# EAGLE design inputs (EAGLE 8.6.0)
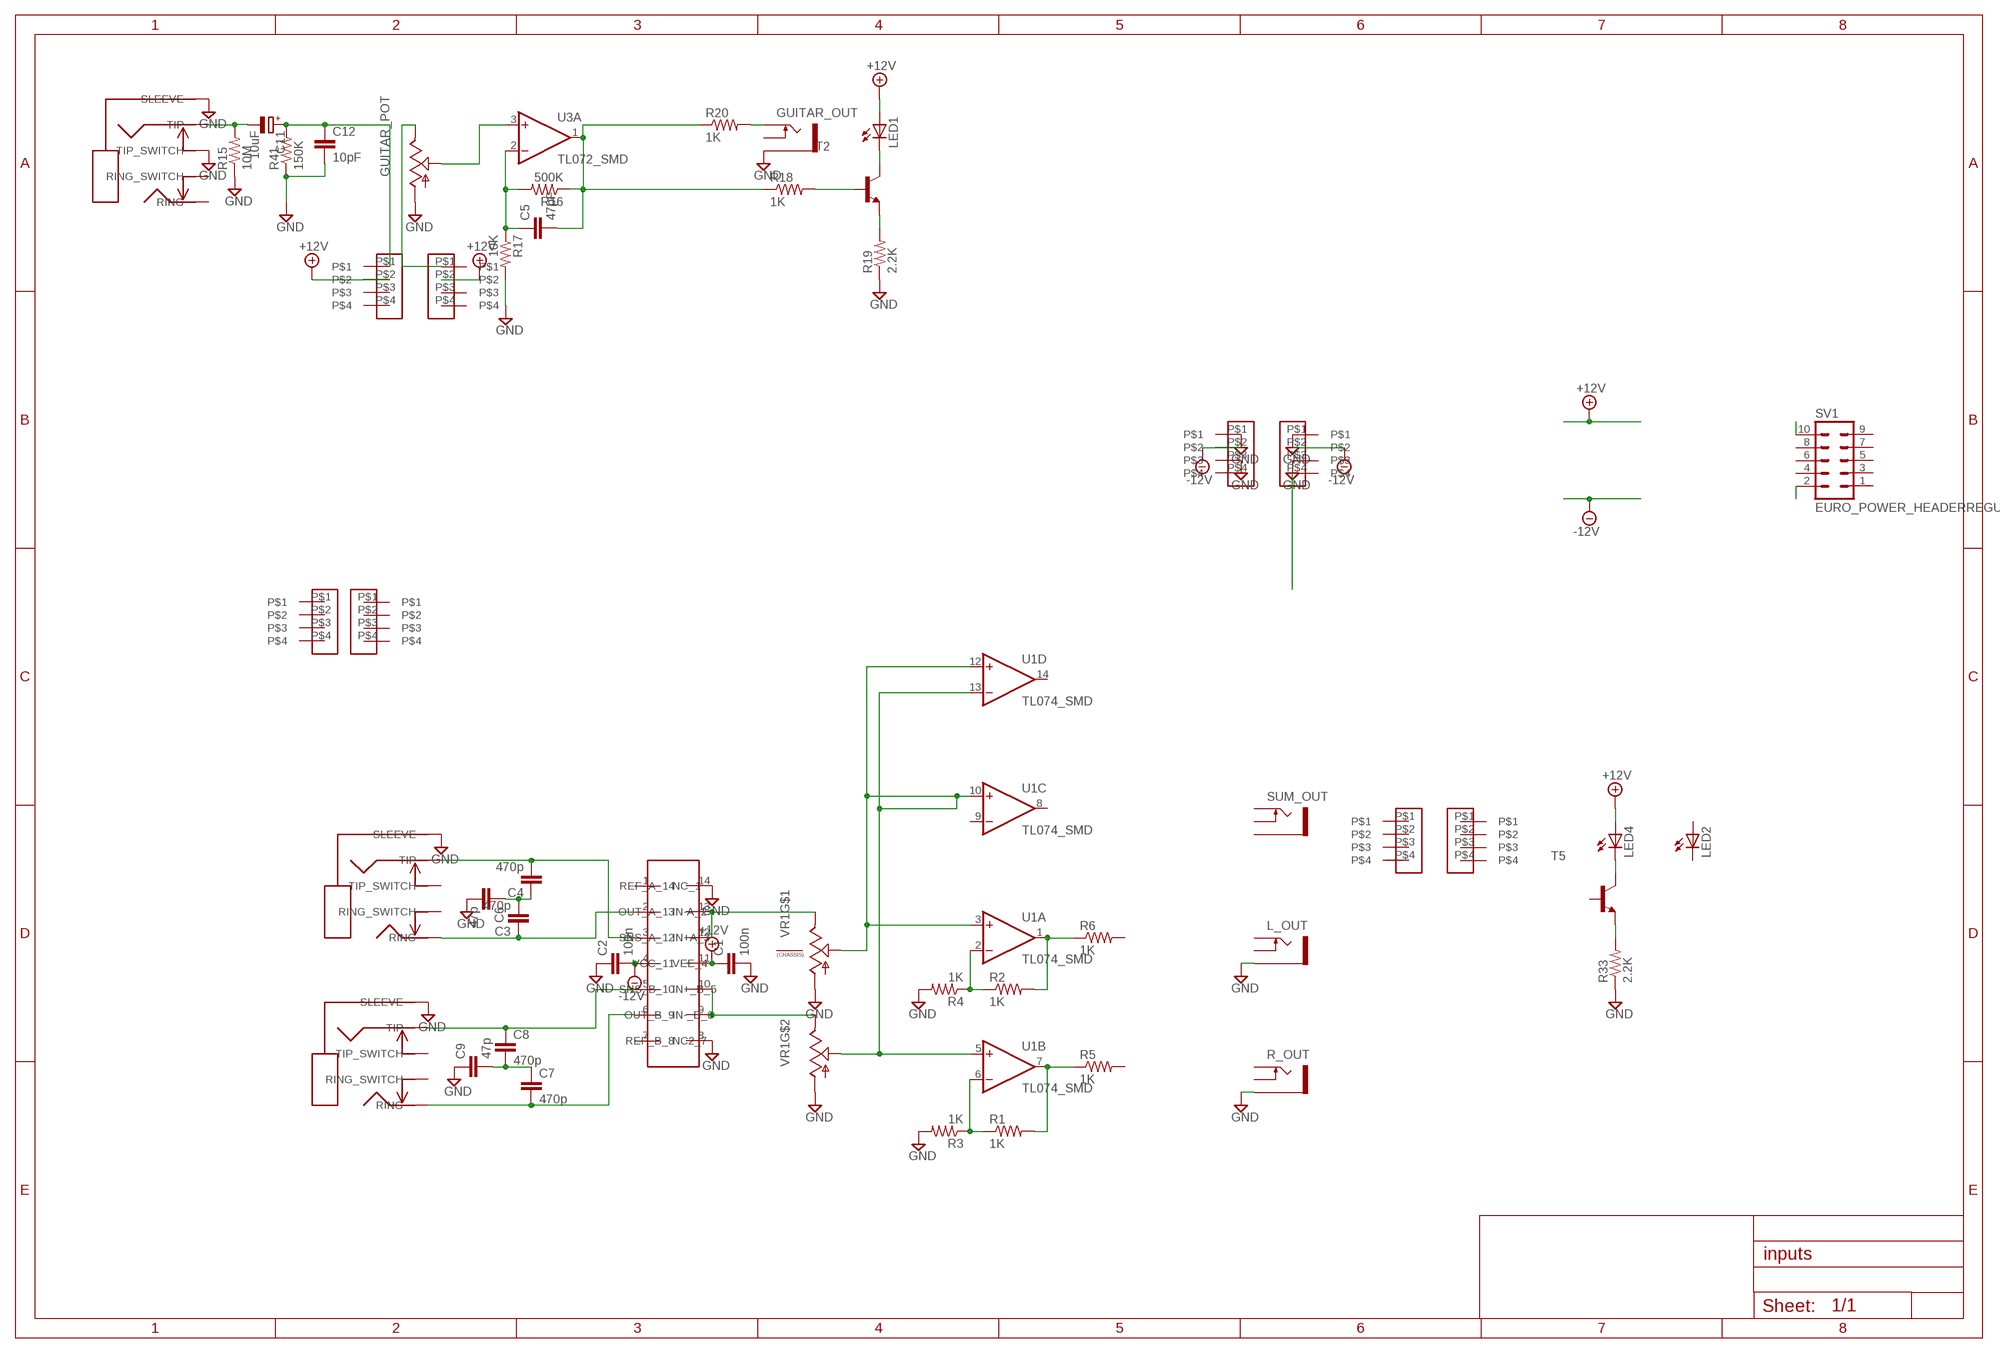
[diagram p0: schematic, sheet 1]

## Parts
C1  100n  C-EUC0603  [C0603]
C2  100n  C-EUC0603  [C0603]
C3  470p  C-EUC0603  [C0603]
C4  470p  C-EUC0603  [C0603]
C5  47pF  C-EUC0603  [C0603]
C6  47p  C-EUC0603  [C0603]
C7  470p  C-EUC0603  [C0603]
C8  470p  C-EUC0603  [C0603]
C9  47p  C-EUC0603  [C0603]
C11  10uF  CPOL-EUB  [PANASONIC_B]
C12  10pF  C-EUC0603  [C0603]
GUITAR_INPUT  WQP-PJ612A  [JACK]
GUITAR_OUT  THONKICONNNEW  [WQP-PJ301M-12_JACK]
GUITAR_POT  9MM_SNAP-IN_POT_  [9MM_SNAP-IN_POT]
L_IN  WQP-PJ612A  [JACK]
L_OUT  THONKICONNNEW  [WQP-PJ301M-12_JACK]
LB_B  4PIN_HEADER  [4PIN]
LB_O  4PIN_HEADER  [4PIN]
LED1  LED3MM  [LED3MM]
LED2  LED3MM  [LED3MM]
LED4  LED3MM  [LED3MM]
R1  1K  R-US_R0603  [R0603]
R2  1K  R-US_R0603  [R0603]
R3  1K  R-US_R0603  [R0603]
R4  1K  R-US_R0603  [R0603]
R5  1K  R-US_R0603  [R0603]
R6  1K  R-US_R0603  [R0603]
R15  10M  R-US_R0603  [R0603]
R16  500K  R-US_R0603  [R0603]
R17  10K  R-US_R0603  [R0603]
R18  1K  R-US_R0603  [R0603]
R19  2.2K  R-US_R0603  [R0603]
R20  1K  R-US_R0603  [R0603]
R33  2.2K  R-US_R0603  [R0603]
R41  150K  R-US_R0603  [R0603]
R-IN  WQP-PJ612A  [JACK]
R_OUT  THONKICONNNEW  [WQP-PJ301M-12_JACK]
RB_B  4PIN_HEADER  [4PIN]
RB_B1  4PIN_HEADER  [4PIN]
RB_O  4PIN_HEADER  [4PIN]
RB_O1  4PIN_HEADER  [4PIN]
RO_B  4PIN_HEADER  [4PIN]
RO_O  4PIN_HEADER  [4PIN]
SUM_OUT  THONKICONNNEW  [WQP-PJ301M-12_JACK]
SV1  EURO_POWER_HEADERREGULAR  [EURO_POWER_HEADER]
T2  MMBT3904LT1-NPN-SOT23-BEC  [SOT23-BEC]
T5  MMBT3904LT1-NPN-SOT23-BEC  [SOT23-BEC]
U1  TL074_SMD  [SO14]
U3  TL072_SMD  [SO08]
U$1  THAT1280  [SO-14]
VR1  ALPHA-9MM-DUALPOT  [DUAL_9MM_SNAP-IN_POT]

## Nets
+12V: C1.1 LB_B.P$2 LB_O.P$2 LED1.A LED4.A U$1.11(VCC_11)
-12V: C2.2 RB_B.P$2 RB_O.P$2 U$1.4(VEE_4)
GND: C1.2 C2.1 C6.2 C9.1 C12.2 GUITAR_INPUT.PIN1(SLEEVE) GUITAR_INPUT.PIN5(TIP_SWITCH) GUITAR_OUT.P$3_SLEEVE(SLEEVE) GUITAR_POT.1(A) L_IN.PIN1(SLEEVE) L_OUT.P$3_SLEEVE(SLEEVE) R3.2 R4.2 R15.1 R17.2 R19.1 R33.1 R41.1 R-IN.PIN1(SLEEVE) R_OUT.P$3_SLEEVE(SLEEVE) RB_B.P$1 RB_B.P$3 RB_O.P$1 RB_O.P$3 U$1.8(REF_B_8) U$1.14(REF_A_14) VR1.1(A) VR1.1B(A)
N$1: C4.2 L_IN.PIN3(TIP) U$1.3(IN+A_3)
N$2: C11.- GUITAR_INPUT.PIN3(TIP) R15.2
N$3: C11.+ C12.1 LB_O.P$1 R41.2
N$4: U$1.9(OUT_B_9) U$1.10(SNS_B_10) VR1.3B(E)
N$5: C8.1 R-IN.PIN3(TIP) U$1.5(IN+_B_5)
N$6: C7.2 R-IN.PIN2(RING) U$1.6(IN-_B_6)
N$7: C3.1 L_IN.PIN2(RING) U$1.2(IN-A_2)
N$8: C7.1 C8.2 C9.2
N$9: C3.2 C4.1 C6.1
N$10: U$1.12(SNS_A_12) U$1.13(OUT_A_13) VR1.3(E)
N$11: R2.1 R4.1 U1.2(A:-IN)
N$12: U1.3(A:+IN) U1.5(B:+IN) U1.10(C:+IN) U1.12(D:+IN) U1.13(D:-IN) VR1.2(S) VR1.2B(S)
N$13: R2.2 R6.1 U1.1(A:OUT)
N$14: R1.1 R3.1 U1.6(B:-IN)
N$15: R1.2 R5.1 U1.7(B:OUT)
N$17: C5.2 R16.1 R18.1 R20.1 U3.1(A:OUT)
N$18: C5.1 R16.2 R17.1 U3.2(A:-IN)
N$19: GUITAR_OUT.P$1_TIP(TIP) R20.2
N$20: R18.2 T2.B
N$21: R19.2 T2.E
N$22: LED1.K(C) T2.C
N$27: RB_O.P$4
N$41: R33.2 T5.E
N$42: LED4.K(C) T5.C
N$54: GUITAR_POT.3(E) LB_B.P$1
N$57: GUITAR_POT.2(S) U3.3(A:+IN)
N$59: SV1.10
N$60: SV1.2
Unconnected: GUITAR_INPUT.PIN2(RING) GUITAR_INPUT.PIN4(RING_SWITCH) GUITAR_OUT.P$2_SWITCH(SWITCH) L_IN.PIN4(RING_SWITCH) L_IN.PIN5(TIP_SWITCH) L_OUT.P$1_TIP(TIP) L_OUT.P$2_SWITCH(SWITCH) LB_B.P$3 LB_B.P$4 LB_O.P$3 LB_O.P$4 LED2.A LED2.K(C) R5.2 R6.2 R-IN.PIN4(RING_SWITCH) R-IN.PIN5(TIP_SWITCH) R_OUT.P$1_TIP(TIP) R_OUT.P$2_SWITCH(SWITCH) RB_B1.P$1 RB_B1.P$2 RB_B1.P$3 RB_B1.P$4 RB_B.P$4 RB_O1.P$1 RB_O1.P$2 RB_O1.P$3 RB_O1.P$4 RO_B.P$1 RO_B.P$2 RO_B.P$3 RO_B.P$4 RO_O.P$1 RO_O.P$2 RO_O.P$3 RO_O.P$4 SUM_OUT.P$1_TIP(TIP) SUM_OUT.P$2_SWITCH(SWITCH) SUM_OUT.P$3_SLEEVE(SLEEVE) SV1.1 SV1.3 SV1.4 SV1.5 SV1.6 SV1.7 SV1.8 SV1.9 T5.B U1.8(C:OUT) U1.9(C:-IN) U1.14(D:OUT) U3.5(B:+IN) U3.6(B:-IN) U3.7(B:OUT) U$1.1(NC_1) U$1.7(NC2_7) VR1.CHASSIS1 VR1.CHASSIS2

## Power pins joined to a net without a drawn wire
V+: U1.4(P:V+) U3.8(P:V+)
V-: U1.11(P:V-) U3.4(P:V-)

## Library data of the parts
C1-C9 C12 = resistor:C-EU: CAPACITOR, European symbol
C11 = resistor:CPOL-EU: POLARIZED CAPACITOR, European symbol
GUITAR_INPUT L_IN R-IN = Chrisvossetje:WQP-PJ612A
GUITAR_OUT L_OUT R_OUT SUM_OUT = MusicThingModular:THONKICONN: 3.5mm socket for Eurorack modular synths
GUITAR_POT = MusicThingModular:9MM_SNAP-IN_POT: 9mm vertical snap-in pot, Alpha / Panasonic style
LB_B LB_O RB_B RB_B1 RB_O RB_O1 RO_B RO_O = Chrisvossetje:4PIN_HEADER
LED1 LED2 LED4 = led:LED: LED OSRAM: - CHIPLED LG R971, LG N971, LY N971, LG Q971, LY Q971, LO R971, LY R971 LH N974, LH R974 LS Q976, LO Q976, LY Q976 LO Q996 - Hyper CHIPLED LW Q18S LB Q993, LB Q99A, LB R99A - SideLED LS A670, LO A670, LY A670, LG A670, LP A670 LB A673, LV A673, LT A673, LW A673 LH A674 LY A675 LS A676, LA A676, LO A676, LY A676, LW A676 LS A679, LY A679, LG A679 - Hyper Micro SIDELED® LS Y876, LA Y876, LO Y876, LY Y876 LT Y87S - SmartLED LW L88C, LW L88S LB L89C, LB L89S, LG L890 LS L89K, LO L89K, LY L89K LS L896, LA L896, LO L896, LY L896 - TOPLED LS T670, LO T670, LY T670, LG T670, LP T670 LSG T670, LSP T670, LSY T670, LOP T670, LYG T670 LG T671, LOG T671, LSG T671 LB T673, LV T673, LT T673, LW T673 LH T674 LS T676, LA T676, LO T676, LY T676, LB T676, LH T676, LSB T676, LW T676 LB T67C, LV T67C, LT T67C, LS T67K, LO T67K, LY T67K, LW E67C LS E67B, LA E67B, LO E67B, LY E67B, LB E67C, LV E67C, LT E67C LW T67C LS T679, LY T679, LG T679 LS T770, LO T770, LY T770, LG T770, LP T770 LB T773, LV T773, LT T773, LW T773 LH T774 LS E675, LA E675, LY E675, LS T675 LS T776, LA T776, LO T776, LY T776, LB T776 LHGB T686 LT T68C, LB T68C - Hyper Mini TOPLED® LB M676 - Mini TOPLED Santana® LG M470 LS M47K, LO M47K, LY M47K Source: http://www.osram.convergy.de LUXEON: - LUMILED® LXK2-PW12-R00, LXK2-PW12-S00, LXK2-PW14-U00, LXK2-PW14-V00 LXK2-PM12-R00, LXK2-PM12-S00, LXK2-PM14-U00 LXK2-PE12-Q00, LXK2-PE12-R00, LXK2-PE12-S00, LXK2-PE14-T00, LXK2-PE14-U00 LXK2-PB12-K00, LXK2-PB12-L00, LXK2-PB12-M00, LXK2-PB14-N00, LXK2-PB14-P00, LXK2-PB14-Q00 LXK2-PR12-L00, LXK2-PR12-M00, LXK2-PR14-Q00, LXK2-PR14-R00 LXK2-PD12-Q00, LXK2-PD12-R00, LXK2-PD12-S00 LXK2-PH12-R00, LXK2-PH12-S00 LXK2-PL12-P00, LXK2-PL12-Q00, LXK2-PL12-R00 Source: www.luxeon.com KINGBRIGHT: KA-3528ASYC Source: www.kingbright.com
R1-R6 R15-R20 R33 R41 = resistor:R-US_: RESISTOR, American symbol
SV1 = MusicThingModular:EURO_POWER_HEADER: Power Header 10 pin power header for Eurorack Power Supplies Variants with fatter pads for easier soldering, and the LOCK variant which has 5mil offset pins to hold the component in place before soldering
T2 T5 = MusicThingModular:*-NPN-: NPN Transistror BF959 corrected 2008.03.06
U1 = MusicThingModular:TL074: Generic Quad Op Amp
U3 = MusicThingModular:TL072: Generic Dual Op Amp
U$1 = Chrisvossetje:THAT1280
VR1 = MusicThingModular:ALPHA-9MM-DUALPOT: 9mm vertical snap-in pot, Alpha / Panasonic style, with a connection to the metal chassis for grounding

## Board
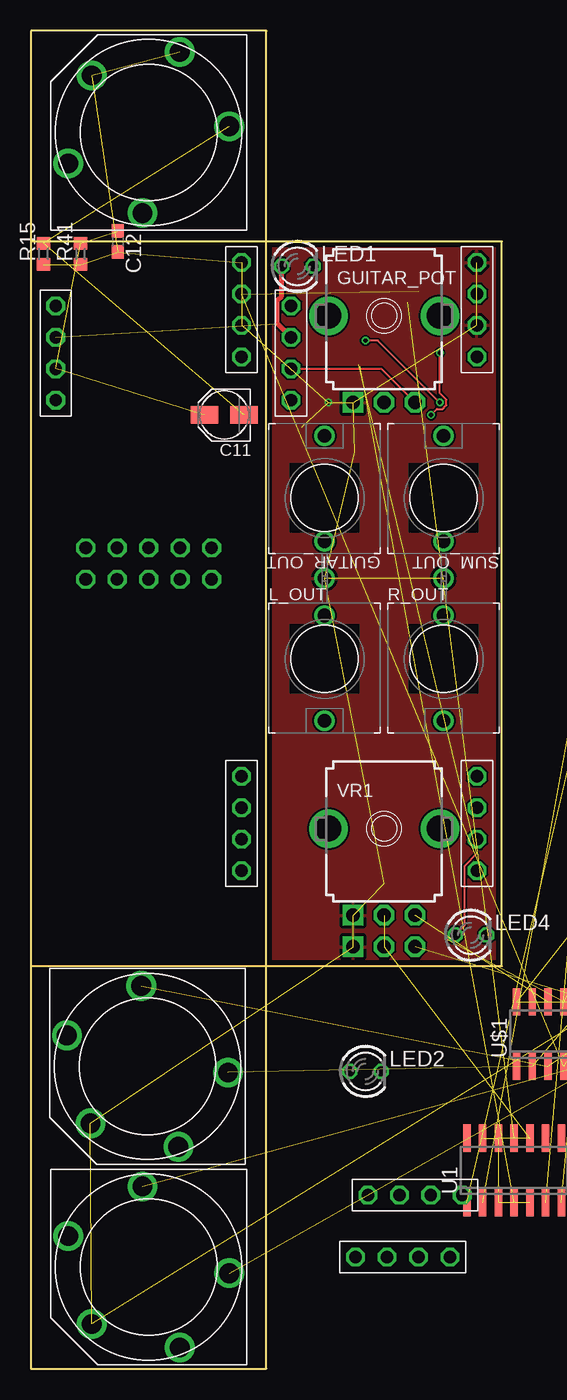
[diagram p1: board, top side]
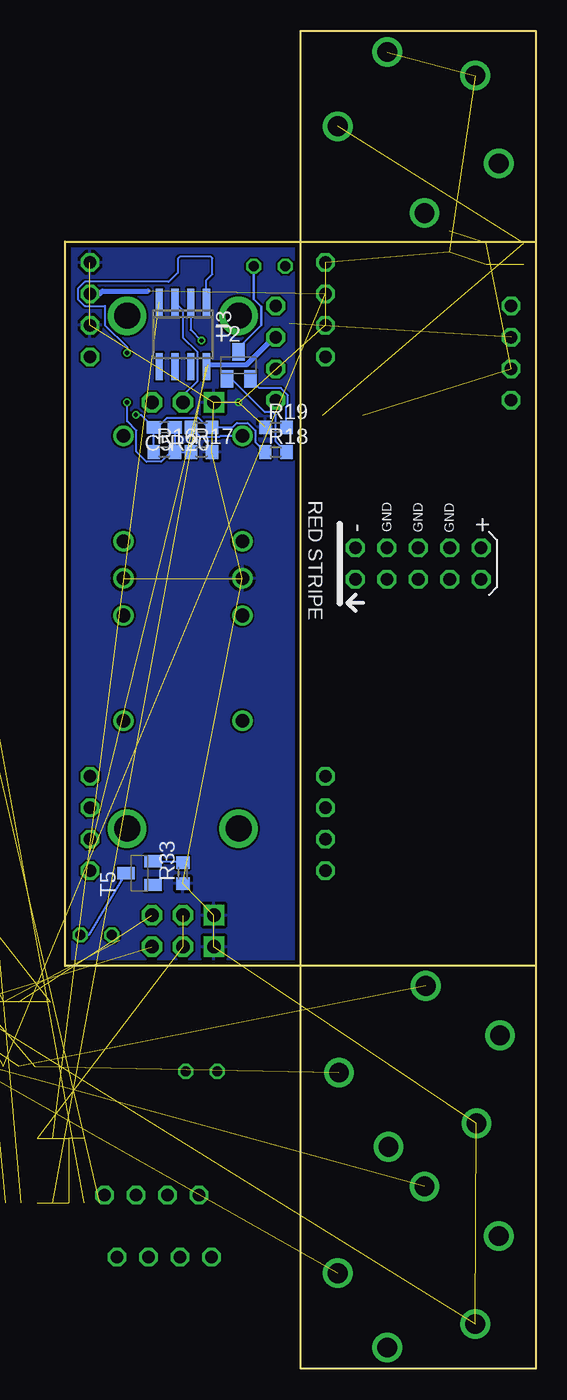
[diagram p2: board, bottom side, seen from below]

Size 38 x 108 mm. Coordinates in mm from the lower left corner, seen from the top.
Outline: 0,91 0,108 19,108 19,0 0,0 0,32.5
Outline: 0,32.5 38,32.5 38,91 0,91
Outline: 0,91 0,32.5
Copper layers (1*16): Top 0.035559375mm / dielectric 1.6mm / Bottom 0.035559375mm
Design rules "oshpark-2layer": minimum track width 6mil, minimum drill 10mil, track to track 6mil, track to pad 6mil, pad to pad 6mil, via to via 6mil, smd to smd 6mil, copper to edge 15mil, drill to drill 6mil, minimum pad ring 5mil, minimum via ring 5mil, stop-mask expansion 2.5mil, vias tented up to drill 0mil, thermal gap 10mil

### Footprints (pad centres in the part's own frame; a part is rotated, then mirrored left to right if it is on the bottom)
C0603 = smd 1.1 x 1: 1 -0.85,0; 2 0.85,0
PANASONIC_B = smd 2.2 x 1.4: + 1.6,0; - -1.6,0
JACK = drill 1.6: PIN1 -4.6,-4.6; PIN2 6.5,-0.5; PIN3 -0.5,6.5; PIN4 2.5,-6.5; PIN5 -6.5,2.5
WQP-PJ301M-12_JACK = drill 1.1: P$1_TIP 0,5; P$2_SWITCH 0,-3.5; P$3_SLEEVE 0,-6.5
9MM_SNAP-IN_POT = drill 1.1 square: 1 -2.5,-7 | drill 1.1 octagon: 2 0,-7; 3 2.5,-7 | drill 2.1 pad 2.794: CHASSIS1 -4.5,0; CHASSIS2 4.5,0
4PIN = drill 1 octagon: P$1 -1.27,0; P$2 1.27,0; P$3 3.81,0; P$4 -3.81,0
LED3MM = drill 0.813 octagon: A -1.27,0; K 1.27,0
R0603 = smd 1 x 1.1: 1 -0.85,0; 2 0.85,0
EURO_POWER_HEADER = drill 1.016 octagon: 1 -5.08,-1.27; 2 -5.08,1.27; 3 -2.54,-1.27; 4 -2.54,1.27; 5 0,-1.27; 6 0,1.27; 7 2.54,-1.27; 8 2.54,1.27; 9 5.08,-1.27; 10 5.08,1.27
SOT23-BEC = smd 1 x 1.4: B -0.95,-1.1; C 0,1.1; E 0.95,-1.1
SO14 = smd 0.6 x 2.2: 1 -3.81,-2.6; 2 -2.54,-2.6; 3 -1.27,-2.6; 4 0,-2.6; 5 1.27,-2.6; 6 2.54,-2.6; 7 3.81,-2.6; 8 3.81,2.6; 9 2.54,2.6; 10 1.27,2.6; 11 0,2.6; 12 -1.27,2.6; 13 -2.54,2.6; 14 -3.81,2.6
SO08 = smd 0.6 x 2.2: 1 -1.905,-2.6; 2 -0.635,-2.6; 3 0.635,-2.6; 4 1.905,-2.6; 5 1.905,2.6; 6 0.635,2.6; 7 -0.635,2.6; 8 -1.905,2.6
SO-14 = smd 0.6 x 2.2: 1 -3.81,-2.6; 2 -2.54,-2.6; 3 -1.27,-2.6; 4 0,-2.6; 5 1.27,-2.6; 6 2.54,-2.6; 7 3.81,-2.6; 8 3.81,2.6; 9 2.54,2.6; 10 1.27,2.6; 11 0,2.6; 12 -1.27,2.6; 13 -2.54,2.6; 14 -3.81,2.6
DUAL_9MM_SNAP-IN_POT = drill 1.1 square: 1 -2.5,-7; 1B -2.5,-9.54 | drill 1.1 octagon: 2 0,-7; 2B 0,-9.54; 3 2.5,-7; 3B 2.5,-9.54 | drill 2.1 pad 2.54: CHASSIS1 -4.5,0; CHASSIS2 4.5,0

### Placement (x,y rotation side)
C1  52,47 0 top  (outside the outline)
C2  52,42 0 top  (outside the outline)
C3  52,37 0 top  (outside the outline)
C4  52,32 0 top  (outside the outline)
C5  30,76 180 bottom
C6  52,27 0 top  (outside the outline)
C7  52,22 0 top  (outside the outline)
C8  52,17 0 top  (outside the outline)
C9  52,12 0 top  (outside the outline)
C11  15.6,77 180 top
C12  7,91 270 top
GUITAR_INPUT  9.5,99.8 270 top
GUITAR_OUT  23.7,70.3 0 top
GUITAR_POT  28.5,85 0 top
L_IN  9.4,24.4 0 top
L_OUT  23.7,57.3 180 top
LB_B  21,82 90 top
LB_O  2,82 90 top
LED1  21.5,89 0 top
LED2  27,24 0 top
LED4  35.5,35 0 top
R1  48,77 0 top  (outside the outline)
R2  48,72 0 top  (outside the outline)
R3  48,67 0 top  (outside the outline)
R4  48,62 0 top  (outside the outline)
R5  48,57 0 top  (outside the outline)
R6  48,52 0 top  (outside the outline)
R15  1,90 90 top
R16  30,74 0 bottom
R17  27,74 0 bottom
R18  21,74 0 bottom
R19  21,76 0 bottom
R20  27,76 180 bottom
R33  28.5,40 90 bottom
R41  4,90 90 top
R-IN  9.5,8.2 0 top
R_OUT  33.3,57.3 180 top
RB_B  36,85.5 90 top
RB_B1  30,9 0 top
RB_O  17,85.5 90 top
RB_O1  31,14 0 top
RO_B  36,44 90 top
RO_O  17,44 90 top
SUM_OUT  33.3,70.3 0 top
SV1  9.5,65 0 bottom
T2  24,81 0 bottom
T5  32,40 90 bottom
U1  39,16 0 top
U3  28.5,83.5 180 bottom
U$1  43,27 0 top
VR1  28.5,43.6 0 top

### Tracks (layer width: path | path; a pad name or v marks a point on that pad's centre or on a via)
+12V  (4 unrouted)
  Top 0.152: 33.6,34.6 34,35 | 36,41.57 35.02,40.59 35.02,35.79 LED4.A
  Top 0.2: 34,35 LED4.A
  Top 0.406: LED1.A 20.23,86.6 19.89,86.27 19.89,84.38 LB_B.P$2
  Bottom 0.406: 26.45,81.04 23.35,81.04 21.13,83.27 LB_B.P$2
-12V  (3 unrouted)
  Bottom 0.406: RB_B.P$2 35.23,86.77 35,87 31.3,87
GND  (via drill 0.35)  (27 unrouted)
  other vias: 24,78
  pour Top: 19,91 19,32.5 38,32.5 38,91
  pour Bottom: 19,91 19,32.5 38,32.5 38,91
N$1  (2 unrouted)
N$2  (2 unrouted)
N$3  (3 unrouted)
N$4  (2 unrouted)
N$5  (2 unrouted)
N$6  (2 unrouted)
N$7  (2 unrouted)
N$8  (2 unrouted)
N$9  (2 unrouted)
N$10  (2 unrouted)
N$11  (2 unrouted)
N$12  (6 unrouted)
N$13  (2 unrouted)
N$14  (2 unrouted)
N$15  (2 unrouted)
N$17  (via drill 0.35)
  Top 0.152: v32.3,77 32.77,77.47 33.22,77.47 33.53,77.78 33.53,78.22 33,78.75 v33,82
  Bottom 0.152: R18.1 22.65,74.8 22.65,75.74 23.26,76.35 24.14,76.35 24.49,76 R20.1 26.48,76 27.25,76.78 29.75,76.78 30.52,76 C5.2 | R16.1 C5.2 | U3.1 26.59,87.88 26.12,88.36 26.12,89.64 26.25,89.78 28.75,89.78 28.91,89.61 28.91,88.48 29.64,87.75 36.41,87.75 36.98,87.17 36.98,86.36 36.41,85.79 34.79,85.79 34.79,84.26 33,82.47 v33,82 | C5.2 31,76 | C5.2 31.85,77 v32.3,77
N$18  (via drill 0.35)
  Top 0.152: v33,78 28,83 v27,83
  Bottom 0.152: C5.1 R16.2 | R16.2 R17.1 | R16.2 29.48,74 30.25,73.22 31.45,73.22 32.25,74.02 32.25,75.74 33,76.49 v33,78 | U3.2 27.86,83.86 v27,83
N$19
  Bottom 0.152: GUITAR_OUT.P$1_TIP 25.48,75.3 25.55,75.22 27.07,75.22 R20.2
N$20
  Bottom 0.152: R18.2 21,74.85 21,77 21.21,77.21 21.89,77.21 24.57,79.9 T2.B
N$21
  Bottom 0.152: T2.E 22.32,79.17 20.59,79.17 20.02,78.59 20.02,77.78 20.15,77.66 R19.2
N$22
  Bottom 0.203: T2.C 24,82.44 22.19,84.25 22.19,85.75 22.77,86.33 LED1.K
N$41
  Bottom 0.152: T5.E 28.6,40.95 R33.2
N$42
  Bottom 0.152: T5.C 36.1,35 LED4.K
N$54
  Top 0.152: LB_B.P$1 28.27,80.73 GUITAR_POT.3
N$57
  Bottom 0.152: U3.3 28.5,85.47 28.5,83.26 27.34,82.09 27.34,79.7 28.5,78.54 GUITAR_POT.2
V+  (1 unrouted)
V-  (1 unrouted)